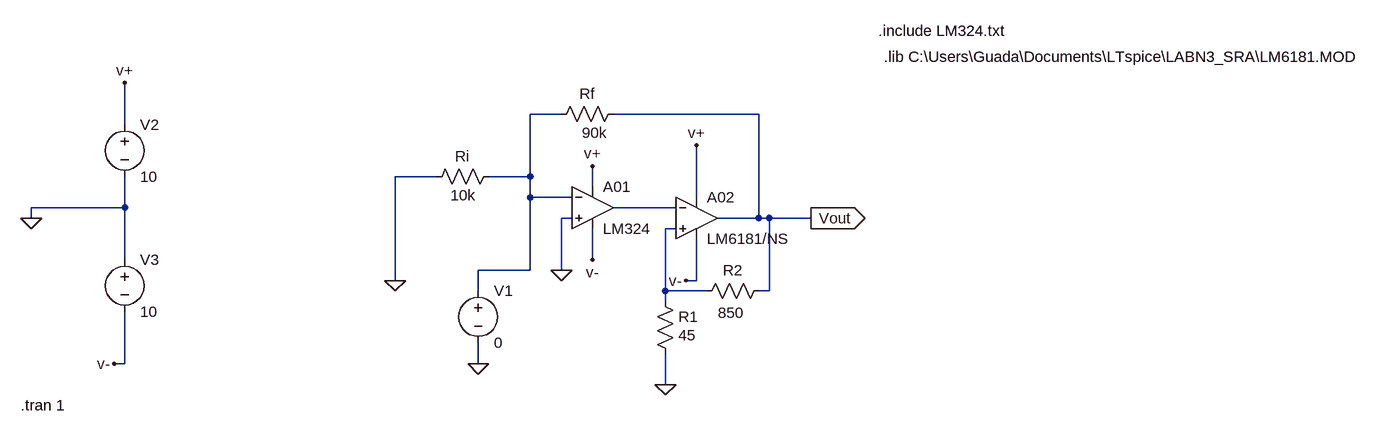
[diagram p0: schematic VFA-CFA.asc]
VFA-CFA.asc, the LTspice schematic file:
Version 4
SHEET 1 1488 680
WIRE 192 48 144 48
WIRE 496 48 272 48
WIRE -480 64 -480 0
WIRE 0 144 -64 144
WIRE 144 144 144 48
WIRE 144 144 80 144
WIRE 240 160 240 128
WIRE 144 176 144 144
WIRE 208 176 144 176
WIRE 400 176 400 96
WIRE -480 192 -480 144
WIRE -480 192 -624 192
WIRE 368 192 272 192
WIRE -624 208 -624 192
WIRE 208 208 192 208
WIRE 496 208 496 48
WIRE 496 208 432 208
WIRE 512 208 496 208
WIRE 576 208 512 208
WIRE 368 224 352 224
WIRE -480 272 -480 192
WIRE 240 272 240 224
WIRE 144 288 144 176
WIRE 144 288 64 288
WIRE 192 288 192 208
WIRE -64 304 -64 144
WIRE 400 304 400 240
WIRE 400 304 384 304
WIRE 64 320 64 288
WIRE 352 320 352 224
WIRE 416 320 352 320
WIRE 512 320 512 208
WIRE 512 320 496 320
WIRE 352 336 352 320
WIRE -480 432 -480 352
WIRE -480 432 -496 432
WIRE 64 432 64 400
WIRE 352 464 352 416
FLAG 576 208 Vout
IOPIN 576 208 Out
FLAG 192 288 0
FLAG -64 304 0
FLAG 64 432 0
FLAG 352 464 0
FLAG -624 208 0
FLAG -480 0 v+
FLAG 240 128 v+
FLAG 400 96 v+
FLAG 384 304 v-
FLAG 240 272 v-
FLAG -496 432 v-
SYMBOL res 96 128 R90
WINDOW 0 0 56 VBottom 2
WINDOW 3 60 55 VBottom 2
SYMATTR InstName Ri
SYMATTR Value 10k
SYMBOL OpAmps\\opamp2 240 128 R0
SYMATTR InstName A01
SYMATTR Value LM324
SYMBOL res 288 32 R90
WINDOW 0 0 56 VBottom 2
WINDOW 3 60 45 VBottom 2
SYMATTR InstName Rf
SYMATTR Value 90k
SYMBOL voltage 64 304 R0
WINDOW 123 0 0 Left 0
WINDOW 39 0 0 Left 0
SYMATTR InstName V1
SYMATTR Value 0
SYMBOL OpAmps\\opamp2 400 144 R0
SYMATTR InstName A02
SYMATTR Value LM6181/NS
SYMBOL res 336 320 R0
WINDOW 3 36 68 Left 2
SYMATTR InstName R1
SYMATTR Value 45
SYMBOL res 512 304 R90
WINDOW 0 0 56 VBottom 2
WINDOW 3 65 59 VBottom 2
SYMATTR InstName R2
SYMATTR Value 850
SYMBOL voltage -480 48 R0
SYMATTR InstName V2
SYMATTR Value 10
SYMBOL voltage -480 256 R0
SYMATTR InstName V3
SYMATTR Value 10
TEXT 680 -80 Left 2 !.include LM324.txt
TEXT -640 496 Left 2 !.tran 1
TEXT 688 -40 Left 2 !.lib C:\\Users\\Guada\\Documents\\LTspice\\LABN3_SRA\\LM6181.MOD

The netlist it stands for:
* VFA-CFA.asc
Ri N001 0 10k
XA01 0 N001 v+ v- N002 LM324  ; pins In+ In- V+ V- OUT
Rf Vout N001 90k
V1 N001 0 0
XA02 N003 N002 v+ v- Vout LM6181/NS  ; pins In+ In- V+ V- OUT
R1 N003 0 45
R2 Vout N003 850
V2 v+ 0 10
V3 0 v- 10
.include LM324.txt
.tran 1
.lib C:\Users\Guada\Documents\LTspice\LABN3_SRA\LM6181.MOD
.backanno
.end